# Altium schematic sheet Vol_schem.SchDoc
size A4
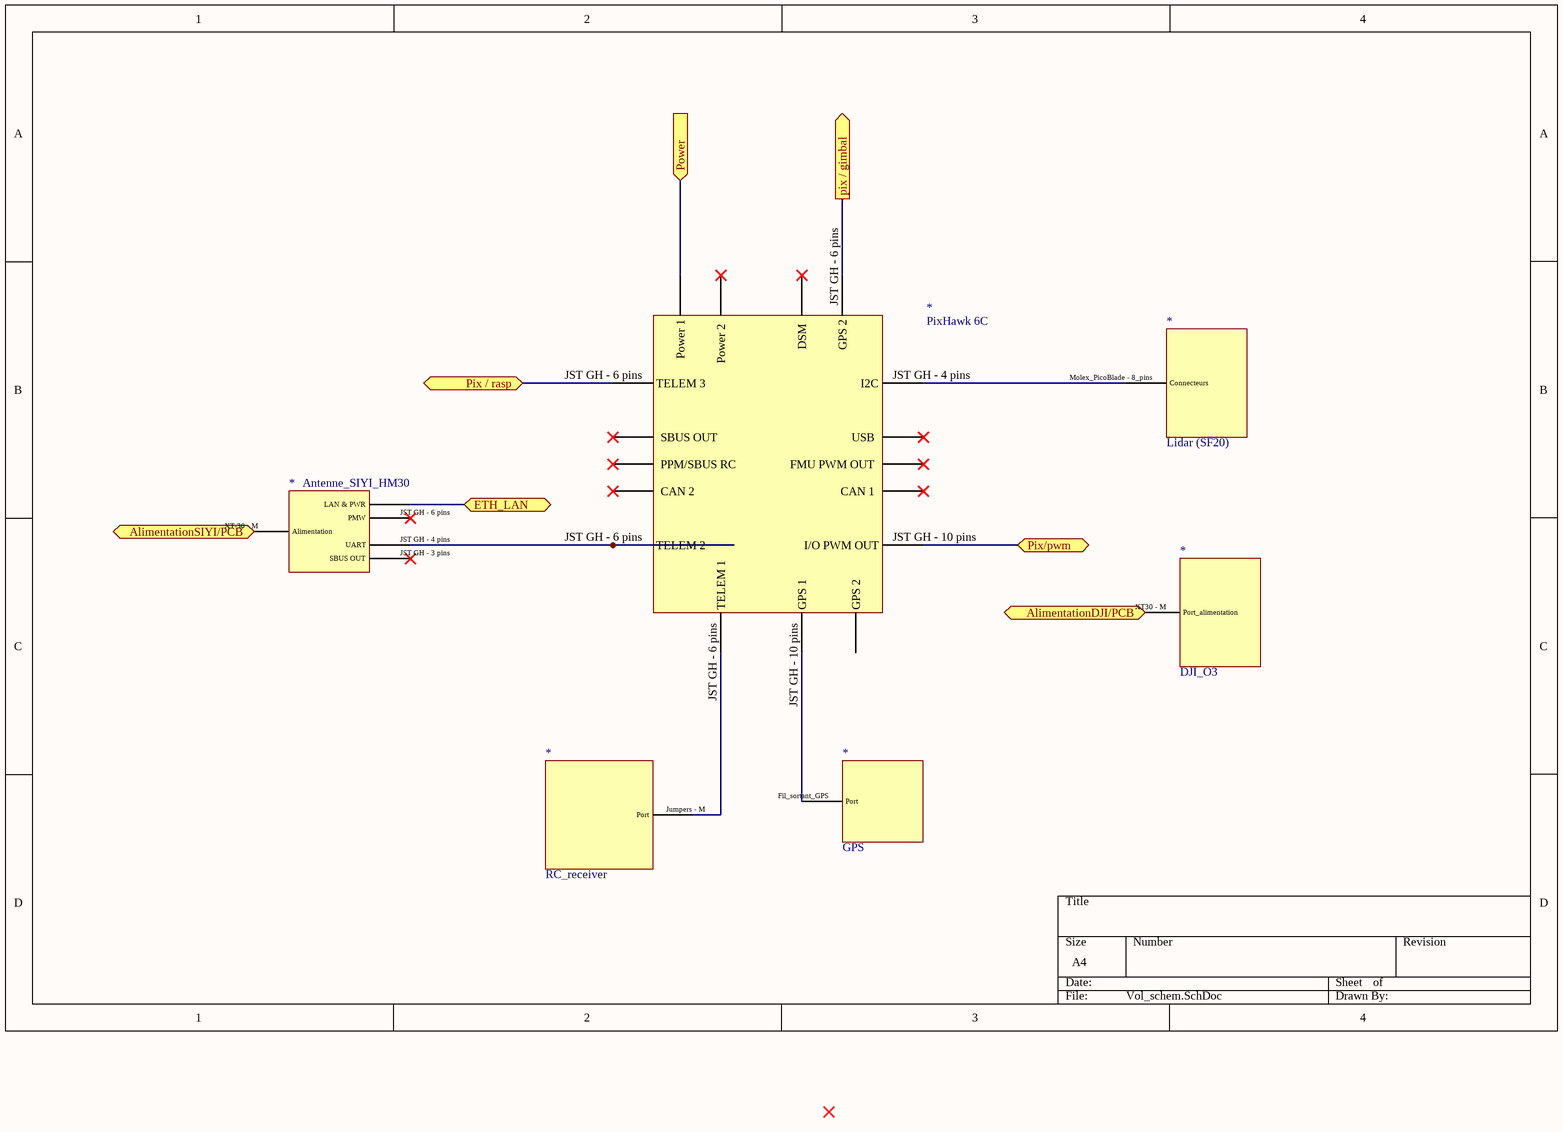
[diagram p0: Vol_schem.SchDoc]

## Parts
(Parts that share a designator on the sheet are numbered #1, #2 ... from top to bottom, then left to right.)
*#1  Lidar (SF20)
*#2  PixHawk 6C
*#3  Antenne_SIYI_HM30
*#4  DJI_O3
*#5  GPS
*#6  RC_receiver

## Ports
AlimentationDJI/PCB (bidir), AlimentationSIYI/PCB (bidir), ETH_LAN (bidir), pix / gimbal (out), Pix / rasp (bidir), Pix/pwm (bidir), Power (in)

## Nets
ETH_LAN: *#3.?1(LAN_&_PWR) ; port ETH_LAN
pix / gimbal: *#2.JST_GH_-_6_pins(GPS_2) ; port pix / gimbal
Pix / rasp: *#2.JST_GH_-_6_pins(TELEM_3) ; port Pix / rasp
Pix/pwm: *#2.JST_GH_-_10_pins(I/O_PWM_OUT) ; port Pix/pwm
Power: *#2.?1(Power_1) ; port Power
Net*#1_Molex_PicoBlade - 8_pins: *#1.Molex_PicoBlade_-_8_pins(Connecteurs) *#2.JST_GH_-_4_pins(I2C)
Net*#2_JST GH - 6 pins: *#2.JST_GH_-_6_pins(TELEM_2) *#3.JST_GH_-_4_pins(UART)
Net*#2_JST GH - 6 pins: *#2.JST_GH_-_6_pins(TELEM_1) *#6.Jumpers_-_M(Port)  [a separate net that carries the same name]
Net*#2_JST GH - 10 pins: *#2.JST_GH_-_10_pins(GPS_1) *#5.Fil_sortant_GPS(Port)

Not connected (* = marked no-connect by the designer): *#2 ?2(Power_2)* ?3(DSM)* ?4(USB)* ?5(CAN_1)* ?6(SBUS_OUT)* ?7(CAN_2)* ?8(GPS_2) ?9(FMU_PWM_OUT)* ?10(PPM/SBUS_RC)*; *#3 JST GH - 3 pins(SBUS_OUT)* JST GH - 6 pins(PMW)* XT-30 - M(Alimentation); *#4 XT30 - M(Port_alimentation)

## Library data of the parts
*#1 = DJI_O3